# EAGLE design LEDCube (EAGLE 5.10)

## Sheet 1 of 4
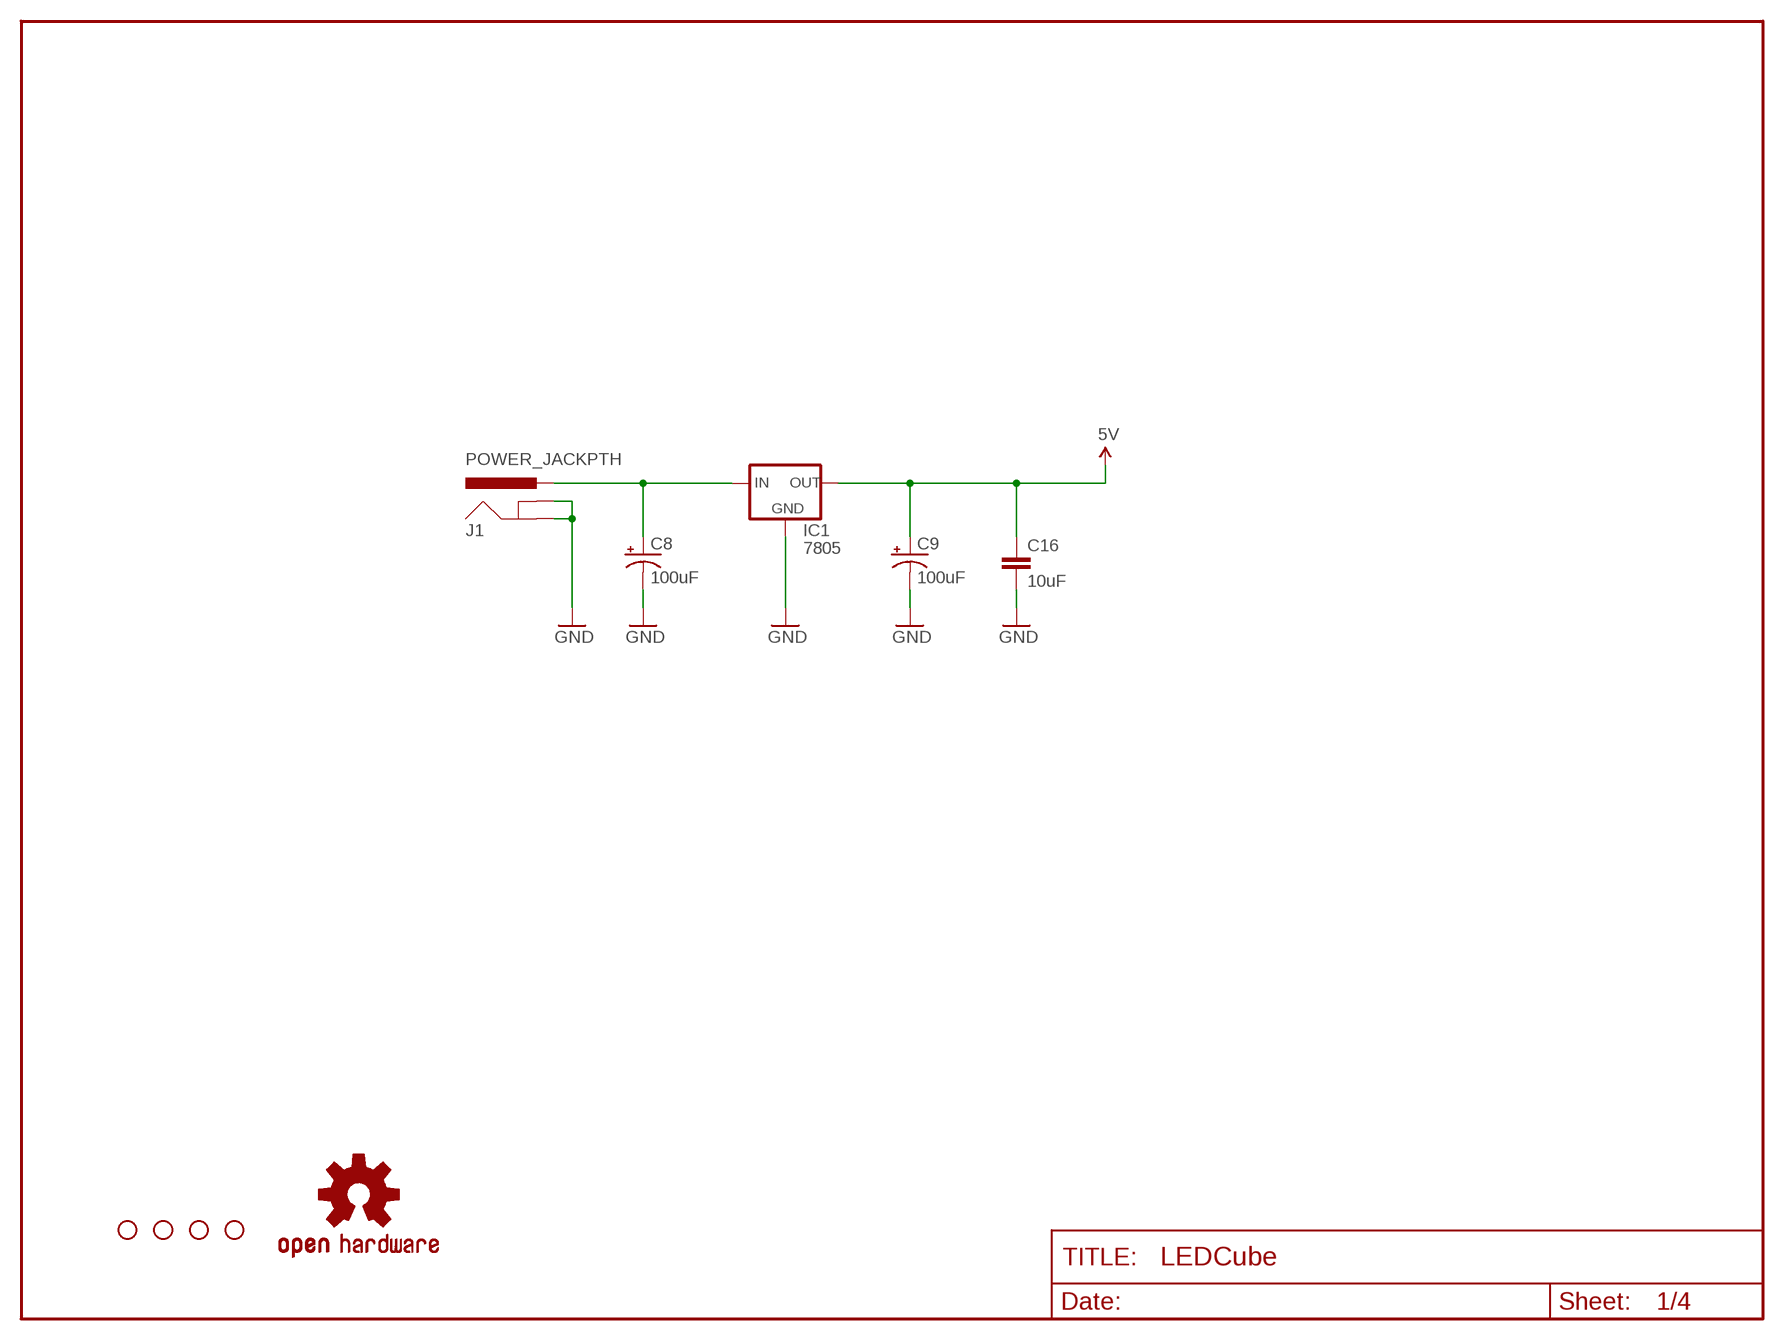
[diagram p0: schematic, sheet 1]

### Parts
C8  100uF  CAP_POLPTH1  [CPOL-RADIAL-100UF-25V]
C9  100uF  CAP_POLPTH1  [CPOL-RADIAL-100UF-25V]
C16  10uF  CAPPTH2  [CAP-PTH-SMALL2]
IC1  7805  V_REG_78XXSINK  [TO220-IGO]
J1  POWER_JACKPTH  [POWER_JACK_PTH]
JP4  STAND-OFF  [STAND-OFF]
JP5  STAND-OFF  [STAND-OFF]
JP6  STAND-OFF  [STAND-OFF]
JP7  STAND-OFF  [STAND-OFF]
U$10  OSHW-LOGOM  [OSHW-LOGO-M]

### Nets
5V: C9.1(+) C16.1 IC1.OUT ; also sheet 2,3,4
GND: C8.2(-) C9.2(-) C16.2 IC1.GND J1.GND J1.GNDBREAK ; also sheet 2,3,4
N$71: C8.1(+) IC1.IN J1.PWR

## Sheet 2 of 4
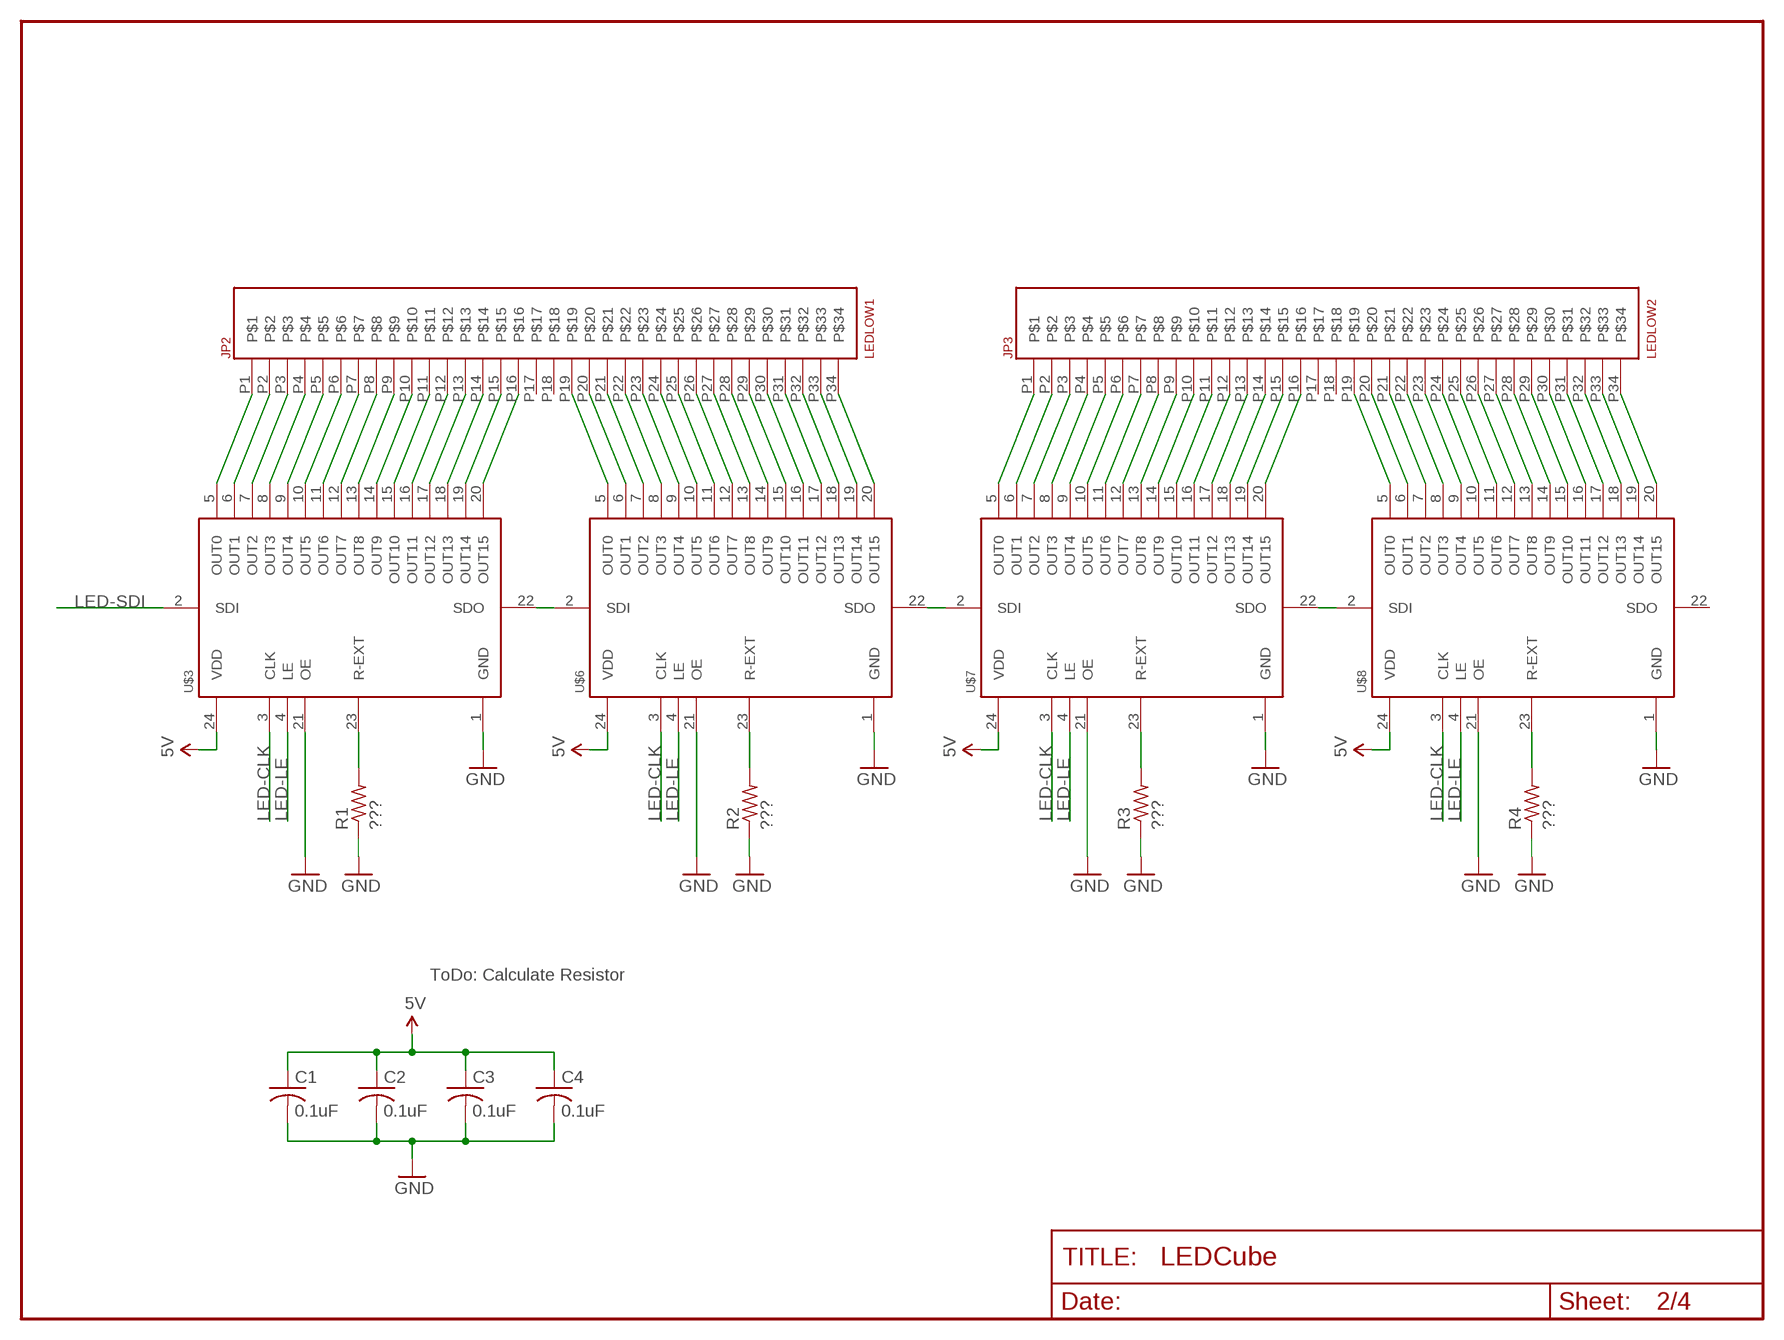
[diagram p1: schematic, sheet 2]

### Parts
C1  0.1uF  C-USC0805  [C0805]
C2  0.1uF  C-USC0805  [C0805]
C3  0.1uF  C-USC0805  [C0805]
C4  0.1uF  C-USC0805  [C0805]
JP2  LEDLOW1  M2X17  [2X17]
JP3  LEDLOW2  M2X17  [2X17]
R1  ???  R-US_R0805  [R0805]
R2  ???  R-US_R0805  [R0805]
R3  ???  R-US_R0805  [R0805]
R4  ???  R-US_R0805  [R0805]
U$3  TLC5925  [TSSOP24]
U$6  TLC5925  [TSSOP24]
U$7  TLC5925  [TSSOP24]
U$8  TLC5925  [TSSOP24]

### Nets
5V: C1.1 C2.1 C3.1 C4.1 U$3.24(VDD) U$6.24(VDD) U$7.24(VDD) U$8.24(VDD) ; also sheet 1,3,4
GND: C1.2 C2.2 C3.2 C4.2 R1.1 R2.1 R3.1 R4.1 U$3.1(GND) U$3.21(OE) U$6.1(GND) U$6.21(OE) U$7.1(GND) U$7.21(OE) U$8.1(GND) U$8.21(OE) ; also sheet 1,3,4
LED1TO2: U$3.22(SDO) U$6.2(SDI)
LED2TO3: U$6.22(SDO) U$7.2(SDI)
LED3-4: U$7.22(SDO) U$8.2(SDI)
LED-CLK: U$3.3(CLK) U$6.3(CLK) U$7.3(CLK) U$8.3(CLK) ; also sheet 4
LED-LE: U$3.4(LE) U$6.4(LE) U$7.4(LE) U$8.4(LE) ; also sheet 4
LED-SDI: U$3.2(SDI) ; also sheet 4
N$1: JP2.P1 U$3.5(OUT0)
N$2: JP2.P2 U$3.6(OUT1)
N$3: JP2.P3 U$3.7(OUT2)
N$4: R4.2 U$8.23(R-EXT)
N$5: R3.2 U$7.23(R-EXT)
N$6: R2.2 U$6.23(R-EXT)
N$7: R1.2 U$3.23(R-EXT)
N$8: JP2.P4 U$3.8(OUT3)
N$9: JP2.P5 U$3.9(OUT4)
N$10: JP2.P6 U$3.10(OUT5)
N$11: JP2.P7 U$3.11(OUT6)
N$12: JP2.P8 U$3.12(OUT7)
N$13: JP2.P9 U$3.13(OUT8)
N$14: JP2.P10 U$3.14(OUT9)
N$15: JP2.P11 U$3.15(OUT10)
N$16: JP2.P12 U$3.16(OUT11)
N$17: JP2.P13 U$3.17(OUT12)
N$18: JP2.P14 U$3.18(OUT13)
N$19: JP2.P15 U$3.19(OUT14)
N$20: JP2.P16 U$3.20(OUT15)
N$21: JP2.P34 U$6.20(OUT15)
N$22: JP2.P33 U$6.19(OUT14)
N$23: JP2.P32 U$6.18(OUT13)
N$24: JP2.P31 U$6.17(OUT12)
N$25: JP2.P30 U$6.16(OUT11)
N$26: JP2.P29 U$6.15(OUT10)
N$27: JP2.P28 U$6.14(OUT9)
N$28: JP2.P27 U$6.13(OUT8)
N$29: JP2.P26 U$6.12(OUT7)
N$30: JP2.P25 U$6.11(OUT6)
N$31: JP2.P24 U$6.10(OUT5)
N$32: JP2.P23 U$6.9(OUT4)
N$33: JP2.P22 U$6.8(OUT3)
N$34: JP2.P21 U$6.7(OUT2)
N$35: JP2.P20 U$6.6(OUT1)
N$36: JP2.P19 U$6.5(OUT0)
N$37: JP3.P1 U$7.5(OUT0)
N$38: JP3.P2 U$7.6(OUT1)
N$39: JP3.P3 U$7.7(OUT2)
N$40: JP3.P4 U$7.8(OUT3)
N$41: JP3.P5 U$7.9(OUT4)
N$42: JP3.P6 U$7.10(OUT5)
N$43: JP3.P7 U$7.11(OUT6)
N$44: JP3.P8 U$7.12(OUT7)
N$45: JP3.P9 U$7.13(OUT8)
N$46: JP3.P10 U$7.14(OUT9)
N$47: JP3.P11 U$7.15(OUT10)
N$48: JP3.P12 U$7.16(OUT11)
N$49: JP3.P13 U$7.17(OUT12)
N$50: JP3.P14 U$7.18(OUT13)
N$51: JP3.P15 U$7.19(OUT14)
N$52: JP3.P16 U$7.20(OUT15)
N$53: JP3.P34 U$8.20(OUT15)
N$54: JP3.P33 U$8.19(OUT14)
N$55: JP3.P32 U$8.18(OUT13)
N$56: JP3.P31 U$8.17(OUT12)
N$57: JP3.P30 U$8.16(OUT11)
N$58: JP3.P29 U$8.15(OUT10)
N$59: JP3.P28 U$8.14(OUT9)
N$60: JP3.P27 U$8.13(OUT8)
N$61: JP3.P26 U$8.12(OUT7)
N$62: JP3.P25 U$8.11(OUT6)
N$63: JP3.P24 U$8.10(OUT5)
N$64: JP3.P23 U$8.9(OUT4)
N$65: JP3.P22 U$8.8(OUT3)
N$66: JP3.P21 U$8.7(OUT2)
N$67: JP3.P20 U$8.6(OUT1)
N$68: JP3.P19 U$8.5(OUT0)
Unconnected: JP2.P17 JP2.P18 JP3.P17 JP3.P18 U$8.22(SDO)

### Notes on the sheet
- ToDo: Calculate Resistor

## Sheet 3 of 4
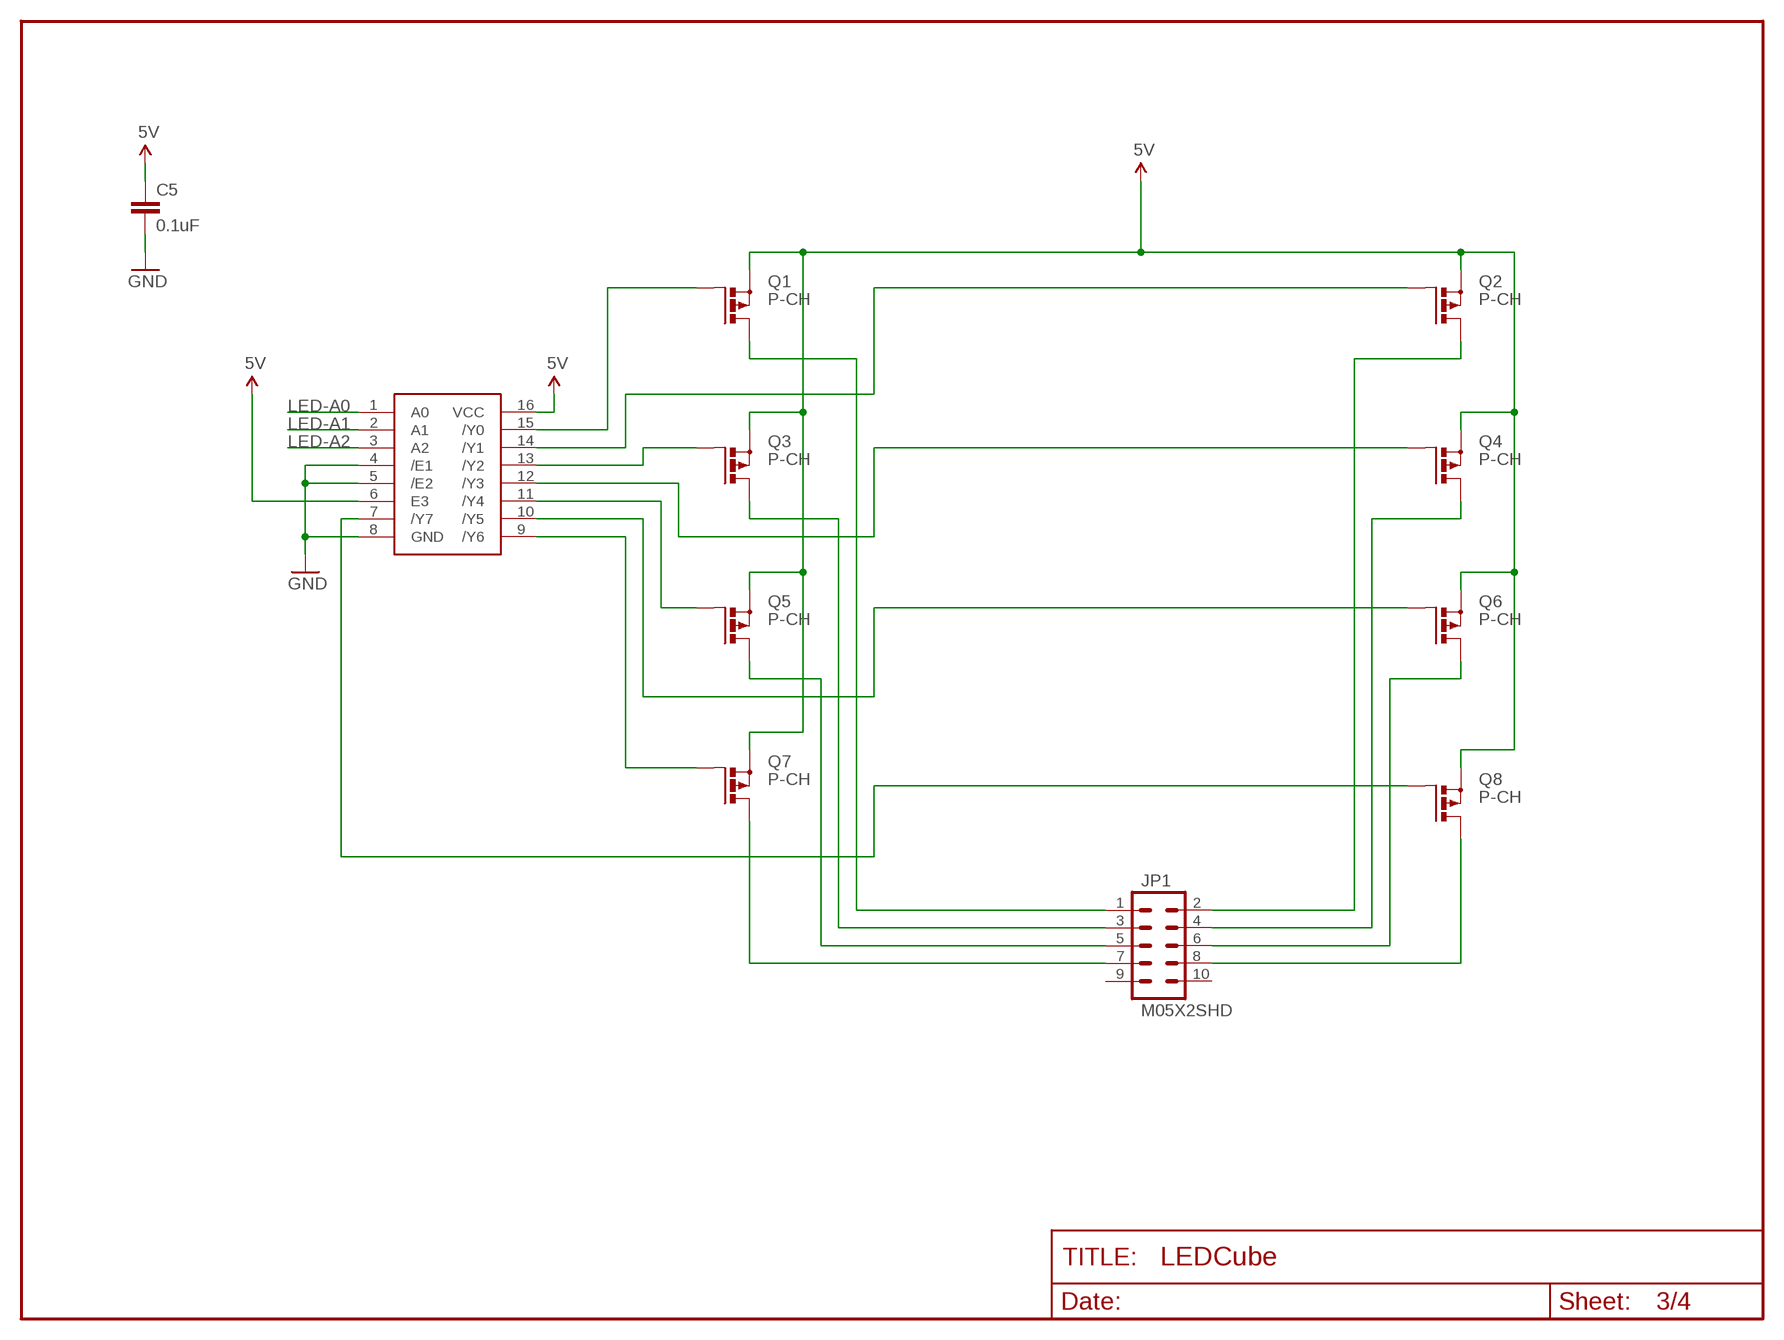
[diagram p2: schematic, sheet 3]

### Parts
C5  0.1uF  CAP0805  [0805]
JP1  M05X2SHD  [2X5-SHROUDED]
Q1  P-CH  PMOSFET_PTO220BV  [TO220BV]
Q2  P-CH  PMOSFET_PTO220BV  [TO220BV]
Q3  P-CH  PMOSFET_PTO220BV  [TO220BV]
Q4  P-CH  PMOSFET_PTO220BV  [TO220BV]
Q5  P-CH  PMOSFET_PTO220BV  [TO220BV]
Q6  P-CH  PMOSFET_PTO220BV  [TO220BV]
Q7  P-CH  PMOSFET_PTO220BV  [TO220BV]
Q8  P-CH  PMOSFET_PTO220BV  [TO220BV]
U$18  74LVC138AD  [SO016]

### Nets
5V: C5.1 Q1.S Q2.S Q3.S Q4.S Q5.S Q6.S Q7.S Q8.S U$18.6(E3) U$18.16(VCC) ; also sheet 1,2,4
GND: C5.2 U$18.4(/E1) U$18.5(/E2) U$18.8(GND) ; also sheet 1,2,4
LED-A0: U$18.1(A0) ; also sheet 4
LED-A1: U$18.2(A1) ; also sheet 4
LED-A2: U$18.3(A2) ; also sheet 4
LEDH1: JP1.1 Q1.D
LEDH2: JP1.2 Q2.D
LEDH3: JP1.3 Q3.D
LEDH4: JP1.4 Q4.D
LEDH5: JP1.5 Q5.D
LEDH6: JP1.6 Q6.D
LEDH7: JP1.7 Q7.D
LEDH8: JP1.8 Q8.D
N$72: Q8.G U$18.7(/Y7)
N$78: Q1.G U$18.15(/Y0)
N$79: Q2.G U$18.14(/Y1)
N$80: Q3.G U$18.13(/Y2)
N$81: Q4.G U$18.12(/Y3)
N$82: Q5.G U$18.11(/Y4)
N$83: Q6.G U$18.10(/Y5)
N$84: Q7.G U$18.9(/Y6)
Unconnected: JP1.9 JP1.10

## Sheet 4 of 4
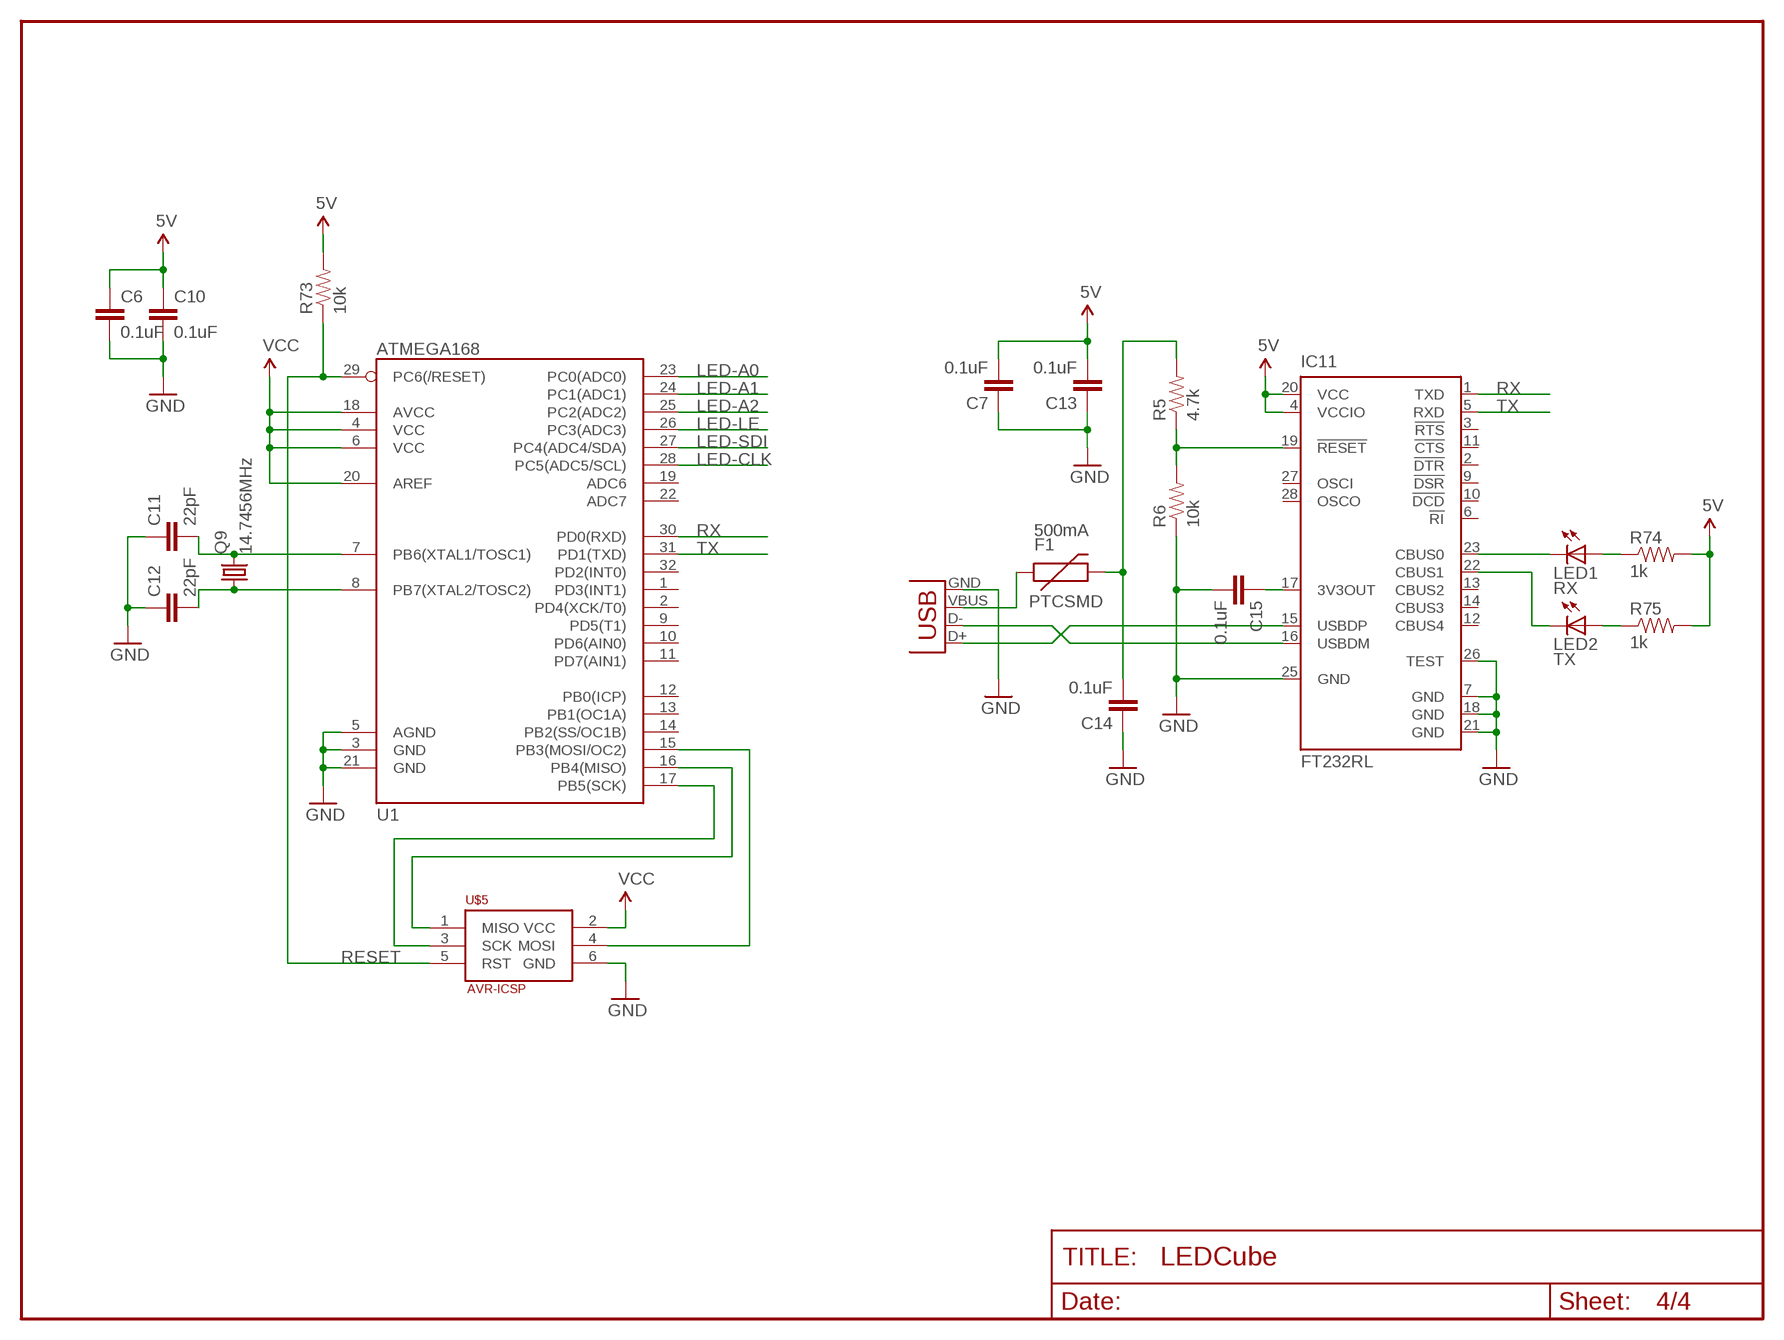
[diagram p3: schematic, sheet 4]

### Parts
C6  0.1uF  CAP0805  [0805]
C7  0.1uF  CAP0805  [0805]
C10  0.1uF  CAP0805  [0805]
C11  22pF  CAP0805  [0805]
C12  22pF  CAP0805  [0805]
C13  0.1uF  CAP0805  [0805]
C14  0.1uF  CAP0805  [0805]
C15  0.1uF  CAP0805  [0805]
F1  PTCSMD  [PTC-1206]
IC11  FT232RL  [SSOP28]
LED1  RX  LED1206  [LED-1206]
LED2  TX  LED1206  [LED-1206]
Q9  14.7456MHz  CRYSTALHC49US  [HC49US]
R5  4.7k  RESISTOR0805-RES  [0805]
R6  10k  RESISTOR0805-RES  [0805]
R73  10k  RESISTOR0805-RES  [0805]
R74  1k  RESISTOR0805-RES  [0805]
R75  1k  RESISTOR0805-RES  [0805]
U1  ATMEGA168  [TQFP32-08]
U$5  AVR-ICSP  AVR-ICSPAVR-ICSP  [AVR-ICSP]
X1  USBSMD  [USB-MINIB]

### Nets
5V: C6.1 C7.2 C10.1 C13.2 IC11.4(VCCIO) IC11.20(VCC) R73.2 R74.2 R75.2 U1.4(VCC) U1.6(VCC) U1.18(AVCC) U1.20(AREF) U$5.2(VCC) ; supply symbol labelled VCC ; also sheet 1,2,3
GND: C6.2 C7.1 C10.2 C11.1 C12.1 C13.1 C14.1 C15.2 IC11.7(GND) IC11.18(GND) IC11.21(GND) IC11.25(GND) IC11.26(TEST) R6.1 U1.3(GND) U1.5(AGND) U1.21(GND) U$5.6(GND) X1.GND ; also sheet 1,2,3
LED-A0: U1.23(PC0(ADC0)) ; also sheet 3
LED-A1: U1.24(PC1(ADC1)) ; also sheet 3
LED-A2: U1.25(PC2(ADC2)) ; also sheet 3
LED-CLK: U1.28(PC5(ADC5/SCL)) ; also sheet 2
LED-LE: U1.26(PC3(ADC3)) ; also sheet 2
LED-SDI: U1.27(PC4(ADC4/SDA)) ; also sheet 2
N$70: IC11.19(!RESET) R5.1 R6.2
N$156: C12.2 Q9.1 U1.8(PB7(XTAL2/TOSC2))
N$157: C11.2 Q9.2 U1.7(PB6(XTAL1/TOSC1))
N$160: IC11.23(CBUS0) LED1.C
N$161: U1.15(PB3(MOSI/OC2)) U$5.4(MOSI)
N$162: U1.16(PB4(MISO)) U$5.1(MISO)
N$163: U1.17(PB5(SCK)) U$5.3(SCK)
N$164: IC11.22(CBUS1) LED2.C
N$165: IC11.15(USBDP) X1.D+
N$166: LED2.A R75.1
N$167: LED1.A R74.1
N$168: IC11.16(USBDM) X1.D-
N$169: F1.1 X1.VBUS
N$170: C15.1 IC11.17(3V3OUT)
N$171: C14.2 F1.2 R5.2
RESET: R73.1 U1.29(PC6(/RESET)) U$5.5(RST)
RX: IC11.1(TXD) U1.30(PD0(RXD))
TX: IC11.5(RXD) U1.31(PD1(TXD))
Unconnected: IC11.2(!DTR) IC11.3(!RTS) IC11.6(!RI) IC11.9(!DSR) IC11.10(!DCD) IC11.11(!CTS) IC11.12(CBUS4) IC11.13(CBUS2) IC11.14(CBUS3) IC11.27(OSCI) IC11.28(OSCO) U1.1(PD3(INT1)) U1.2(PD4(XCK/T0)) U1.9(PD5(T1)) U1.10(PD6(AIN0)) U1.11(PD7(AIN1)) U1.12(PB0(ICP)) U1.13(PB1(OC1A)) U1.14(PB2(SS/OC1B)) U1.19(ADC6) U1.22(ADC7) U1.32(PD2(INT0))

### Notes on the sheet
- 500mA

## Library data of the parts
C1-C4 = resistor:C-US: CAPACITOR, American symbol
C5-C7 C10-C16 = SparkFun:CAP: Capacitor Standard 0603 ceramic capacitor, and 0.1" leaded capacitor.
C8 C9 = SparkFun:CAP_POL: Capacitor Polarized These are standard SMD and PTH capacitors. Normally 10uF, 47uF, and 100uF in electrolytic and tantalum varieties. Always verify the external diameter of the through hole cap, it varies with capacity, voltage, and manufacturer. The EIA devices should be standard.
F1 = SparkFun:PTC: Resettable Fuse PTC Resettable Fuse. Spark Fun Electronics SKU : COM-08357
IC1 = SparkFun:V_REG_78XX: Voltage Regulator Standard 7805 5V regulator. IGO (Input Ground Output). Spark Fun Electronics SKU : COM-00107
IC11 = ftdichip:FT232R: Source: http://www.ftdichip.com/Documents/DataSheets/DS_FT232R_v104.pdf
J1 = SparkFun:POWER_JACK: Power Jack This is the standard 5.5mm barrel jack for power. The PTH is the most common, proven, reliable, footprint. All others are experimental. The Slot footprint only works if the mill layer is transmitted to the PCB fab house so be warned. Spark Fun Electronics SKU : PRT-00119. Mating wall wart : TOL-00298 (and others)
JP1 = SparkFun:M05X2: Header 5x2 Standard 10-pin dual row 0.1" header. Commonly used with AVR-ISP. Use with Spark Fun Electronics SKU: PRT-00778
JP2 JP3 = FiveVolt:M2X17
JP4-JP7 = SparkFun:STAND-OFF: Stand Off This is the mechanical footprint for a #4 phillips button head screw. Use the keepout ring to avoid running the screw head into surrounding components. SKU : PRT-00447
LED1 LED2 = SparkFun:LED: LEDs Standard schematic elements and footprints for 5mm, 3mm, 1206, and 0603 sized LEDs. 5mm - Spark Fun Electronics SKU : COM-00529 (and others)
Q1-Q8 = transistor-power:PMOSFET_P: Power MOSFET P-Channel
Q9 = SparkFun:CRYSTAL: Crystals Various standard crystals. Proven footprints. Spark Fun Electronics SKU : COM-00534
R1-R4 = resistor:R-US_: RESISTOR, American symbol
R5 R6 R73-R75 = SparkFun:RESISTOR: Resistor Basic schematic elements and footprints for 0603, 1206, and PTH resistors.
U1 = SparkFun:ATMEGA168
U$3 U$6-U$8 = FiveVolt:TLC5925
U$5 = FiveVolt:AVR-ICSP; EAGLEUP: JP3Q
U$10 = SparkFun:OSHW-LOGO: Open Source Hardware Logo This logo indicates the piece of hardware it is found on incorporates a OSHW license and/or adheres to the definition of open source hardware found here: http://freedomdefined.org/OSHW
U$18 = SparkFun:74LVC138AD
X1 = SparkFun:USB: USB Connectors USB-B-PTH is fully proven SKU : PRT-00139 USB-miniB is fully proven SKU : PRT-00587 USB-A-PCB is untested. USB-A-H is throughly reviewed, but untested. Spark Fun Electronics SKU : PRT-00437 USB-B-SMT is throughly reviewed, but untested. Needs silkscreen touching up. USB-A-S has not been used/tested USB-MB-H has not been used/tested

## Board
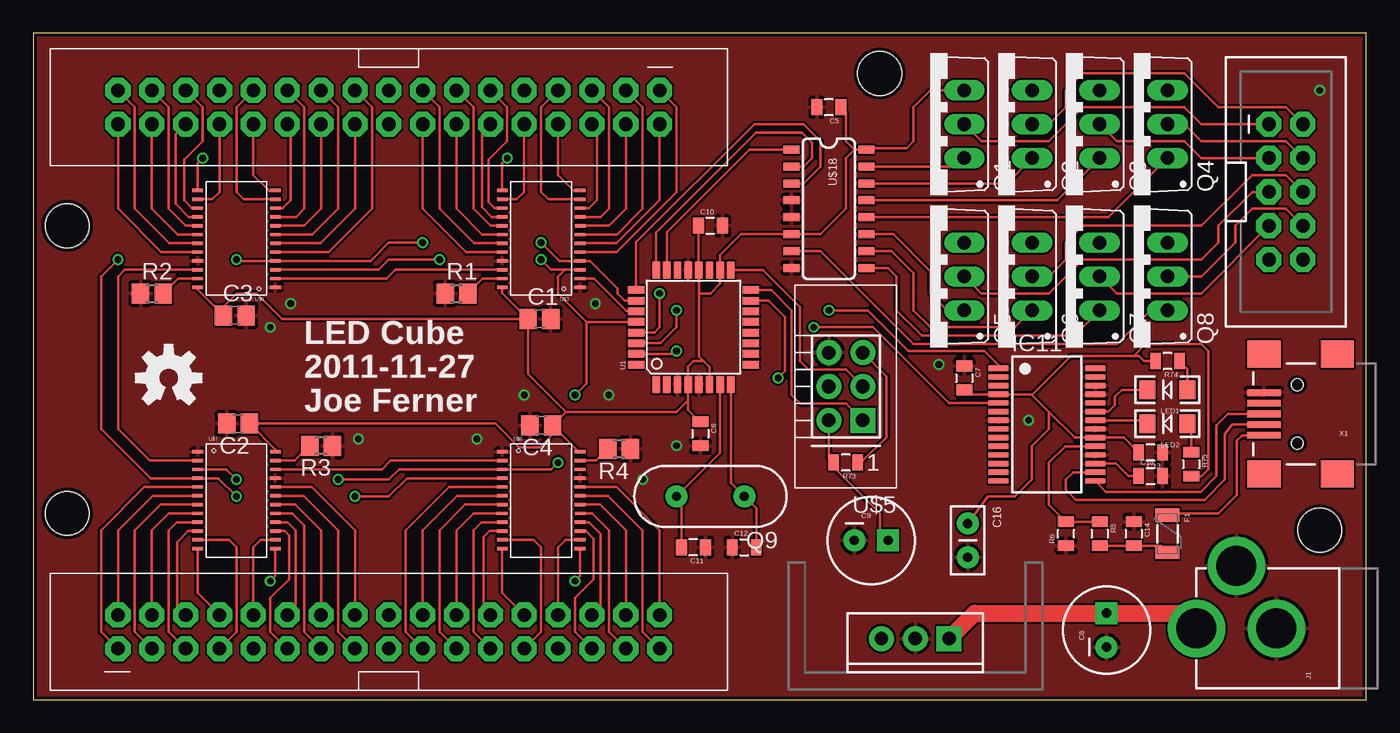
[diagram p4: board, top side]
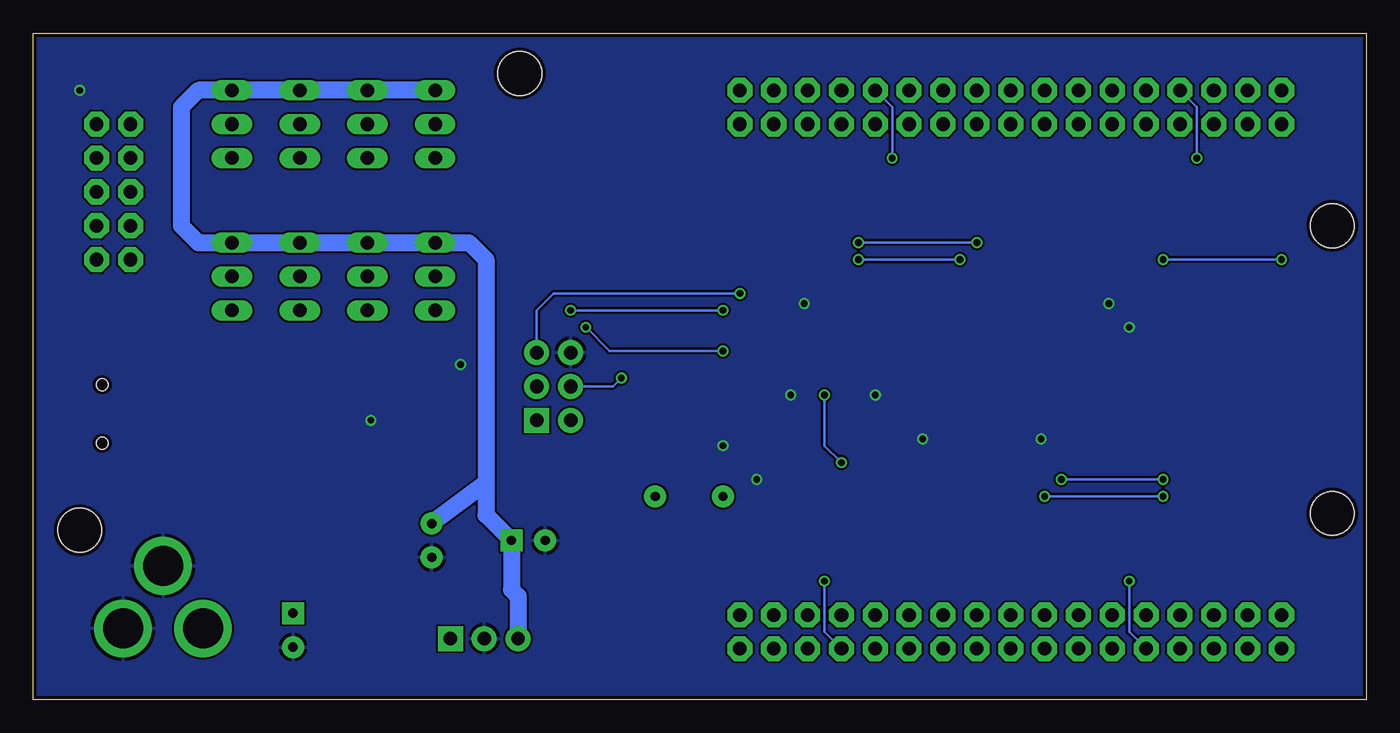
[diagram p5: board, bottom side, seen from below]

Size 100 x 50 mm. Coordinates in mm from the lower left corner, seen from the top.
Outline: 0,0 100,0 100,50 0,50 0,0
Copper layers (1*16): Top 0.035mm / dielectric 1.5mm / Bottom 0.035mm
Design rules "ITead_rule": minimum track width 6mil, minimum drill 12mil, track to track 6mil, track to pad 6mil, pad to pad 6mil, via to via 6mil, smd to smd 0mil, copper to edge 10mil, drill to drill 10mil, minimum pad ring 10mil, minimum via ring 6mil, stop-mask expansion 2mil, vias tented up to drill 100mil, thermal gap 10mil

### Footprints (pad centres in the part's own frame; a part is rotated, then mirrored left to right if it is on the bottom)
C0805 = smd 1.3 x 1.5: 1 -0.85,0; 2 0.85,0
0805 = smd 0.8 x 1.2: 1 -0.9,0; 2 0.9,0
CPOL-RADIAL-100UF-25V = drill 0.7 pad 1.651 square: 1 1.27,0 | drill 0.7 pad 1.651 round: 2 -1.27,0
CAP-PTH-SMALL2 = drill 0.7 pad 1.651 round: 1 0,0; 2 2.54,0
PTC-1206 = smd 1 x 1.8: 1 -1.4,0; 2 1.4,0
TO220-IGO = drill 1 pad 1.88 round: GND 0,0; OUT 2.54,0 | drill 1 pad 1.88 square: IN -2.54,0
SSOP28 = smd 0.4 x 1.5: 1 -4.225,-3.625; 2 -3.575,-3.625; 3 -2.925,-3.625; 4 -2.275,-3.625; 5 -1.625,-3.625; 6 -0.975,-3.625; 7 -0.325,-3.625; 8 0.325,-3.625; 9 0.975,-3.625; 10 1.625,-3.625; 11 2.275,-3.625; 12 2.925,-3.625; 13 3.575,-3.625; 14 4.225,-3.625; 15 4.225,3.625; 16 3.575,3.625; 17 2.925,3.625; 18 2.275,3.625; 19 1.625,3.625; 20 0.975,3.625; 21 0.325,3.625; 22 -0.325,3.625; 23 -0.975,3.625; 24 -1.625,3.625; 25 -2.275,3.625; 26 -2.925,3.625; 27 -3.575,3.625; 28 -4.225,3.625
POWER_JACK_PTH = drill 2.997 pad 4.318 round: GND 0,7.7; GNDBREAK 4.7,10.7; PWR 0,13.7
2X5-SHROUDED = drill 1.016 pad 1.88 octagon: 1 -1.27,5.08; 2 1.27,5.08; 3 -1.27,2.54; 4 1.27,2.54; 5 -1.27,0; 6 1.27,0; 7 -1.27,-2.54; 8 1.27,-2.54; 9 -1.27,-5.08; 10 1.27,-5.08
2X17 = drill 1.016 pad 1.88 octagon: P1 -20.32,-1.27; P2 -20.32,1.27; P3 -17.78,-1.27; P4 -17.78,1.27; P5 -15.24,-1.27; P6 -15.24,1.27; P7 -12.7,-1.27; P8 -12.7,1.27; P9 -10.16,-1.27; P10 -10.16,1.27; P11 -7.62,-1.27; P12 -7.62,1.27; P13 -5.08,-1.27; P14 -5.08,1.27; P15 -2.54,-1.27; P16 -2.54,1.27; P17 0,-1.27; P18 0,1.27; P19 2.54,-1.27; P20 2.54,1.27; P21 5.08,-1.27; P22 5.08,1.27; P23 7.62,-1.27; P24 7.62,1.27; P25 10.16,-1.27; P26 10.16,1.27; P27 12.7,-1.27; P28 12.7,1.27; P29 15.24,-1.27; P30 15.24,1.27; P31 17.78,-1.27; P32 17.78,1.27; P33 20.32,-1.27; P34 20.32,1.27
STAND-OFF = hole 3.302: 0,0
LED-1206 = smd 1.2 x 1.4: A -1.5,0; C 1.5,0
TO220BV = drill 1.016 long: D 0,-2.54; G -2.54,-2.54; S 2.54,-2.54
HC49US = drill 0.7 pad 1.651 round: 1 -2.54,0; 2 2.54,0
R0805 = smd 1.3 x 1.5: 1 -0.85,0; 2 0.85,0
TQFP32-08 = smd 1.27 x 0.559: 1 -4.293,2.8; 2 -4.293,2; 3 -4.293,1.2; 4 -4.293,0.4; 5 -4.293,-0.4; 6 -4.293,-1.2; 7 -4.293,-2; 8 -4.293,-2.8; 17 4.293,-2.8; 18 4.293,-2; 19 4.293,-1.2; 20 4.293,-0.4; 21 4.293,0.4; 22 4.293,1.2; 23 4.293,2; 24 4.293,2.8 | smd 0.559 x 1.27: 9 -2.8,-4.293; 10 -2,-4.293; 11 -1.2,-4.293; 12 -0.4,-4.293; 13 0.4,-4.293; 14 1.2,-4.293; 15 2,-4.293; 16 2.8,-4.293; 25 2.8,4.293; 26 2,4.293; 27 1.2,4.293; 28 0.4,4.293; 29 -0.4,4.293; 30 -1.2,4.293; 31 -2,4.293; 32 -2.8,4.293
TSSOP24 = smd 0.8 x 0.25: 1 -2.921,3.353; 2 -2.921,2.692; 3 -2.921,2.032; 4 -2.921,1.372; 5 -2.921,0.711; 6 -2.921,0.051; 7 -2.921,-0.61; 8 -2.927,-1.27; 9 -2.921,-1.93; 10 -2.921,-2.591; 11 -2.921,-3.251; 12 -2.921,-3.912; 13 2.921,-3.912; 14 2.921,-3.251; 15 2.921,-2.591; 16 2.921,-1.93; 17 2.927,-1.27; 18 2.921,-0.61; 19 2.921,0.051; 20 2.921,0.711; 21 2.921,1.372; 22 2.921,2.032; 23 2.921,2.692; 24 2.921,3.353
AVR-ICSP = drill 1.016 pad 1.88 square: 1 -1.27,2.54 | drill 1.016 pad 1.88 round: 2 1.27,2.54; 3 -1.27,0; 4 1.27,0; 5 -1.27,-2.54; 6 1.27,-2.54
SO016 = smd 0.6 x 1.2: 1 -4.445,-2.8; 2 -3.175,-2.8; 3 -1.905,-2.8; 4 -0.635,-2.8; 5 0.635,-2.8; 6 1.905,-2.8; 7 3.175,-2.8; 8 4.445,-2.8; 9 4.445,2.8; 10 3.175,2.8; 11 1.905,2.8; 12 0.635,2.8; 13 -0.635,2.8; 14 -1.905,2.8; 15 -3.175,2.8; 16 -4.445,2.8
USB-MINIB = smd 2.5 x 0.5: D+ 2.5,0; D- 2.5,0.8; GND 2.5,-1.6; ID 2.5,-0.8; VBUS 2.5,1.6 | smd 2.5 x 2: MTN1 -3,4.5; MTN2 2.5,4.5; MTN3 -3,-4.5; MTN4 2.5,-4.5 | hole 0.9: 0,2.2; 0,-2.2

### Placement (x,y rotation side)
C1  37.97,28.57 0 top
C2  15.37,20.7 180 top
C3  15.11,28.83 0 top
C4  38.1,20.57 180 top
C5  59.69,44.45 180 top
C6  50.04,19.94 270 top
C7  69.85,24.13 270 top
C8  80.52,5.21 90 top
C9  62.87,11.94 0 top
C10  50.8,35.56 0 top
C11  49.53,11.43 180 top
C12  53.34,11.43 0 top
C13  83.82,18.54 180 top
C14  82.55,12.45 270 top
C15  83.82,16.76 0 top
C16  70.1,13.21 270 top
F1  85.09,12.45 270 top
IC1  66.17,4.57 180 top
IC11  76.04,20.63 270 top
J1  100.97,5.33 90 top
JP1  93.98,38.1 0 top
JP2  26.67,44.45 180 top
JP3  26.67,5.08 0 top
JP4  2.54,35.56 0 top
JP5  2.54,13.97 0 top
JP6  96.52,12.7 0 top
JP7  63.5,46.99 0 top
LED1  85.09,23.24 180 top
LED2  85.09,20.7 180 top
Q1  67.31,43.18 90 top
Q2  72.39,43.18 90 top
Q3  77.47,43.18 90 top
Q4  82.55,43.18 90 top
Q5  67.31,31.75 90 top
Q6  72.39,31.75 90 top
Q7  77.47,31.75 90 top
Q8  82.55,31.75 90 top
Q9  50.8,15.24 180 top
R1  31.75,30.48 0 top
R2  8.89,30.48 0 top
R3  21.59,19.05 180 top
R4  43.94,18.8 180 top
R5  80.01,12.45 270 top
R6  77.47,12.45 90 top
R73  60.96,17.78 180 top
R74  85.09,25.4 180 top
R75  86.87,17.65 270 top
U1  49.53,27.94 90 top
U$3  38.1,34.29 180 top
U$5  60.96,23.5 180 top
U$6  15.24,34.29 180 top
U$7  15.24,15.24 0 top
U$8  38.1,15.24 0 top
U$10  10.16,24.13 0 top
U$18  59.69,36.83 270 top
X1  94.83,21.43 180 top

### Tracks (layer width: path | path; a pad name or v marks a point on that pad's centre or on a via)
5V
  Top 0.203: U$7.24 18.16,18.76 C2.1 34.67,20.7 36.45,18.92 37.97,18.92 38.95,19.9 C4.1 | U$8.24 40.93,18.59 C4.1 | U$6.24 12.32,30.77 C3.1 14.26,29.5 15.24,30.48 16.76,30.48 18.67,28.57 C1.1 | 61.59,41.27 U$18.16 62.48,41.4 65.53,41.4 66.04,41.91 66.04,44.45 67.31,45.72 Q1.S | 61.59,41.27 60.96,40.64 60.96,36.83 59.05,34.92 U$18.6 53.09,34.92 51.53,33.37 U1.18 51.53,31.21 50.8,30.48 49.93,30.48 | 61.59,41.27 60.96,41.91 60.96,44.08 C5.1 | 76.2,21.59 74.93,22.86 | 74.93,22.86 74.89,22.91 IC11.4 70.17,22.91 C7.2 | 76.2,21.59 78.14,19.66 IC11.20 81.81,19.66 C13.2 | U1.6 50.73,24.96 50.29,25.4 | 50.29,25.4 49.53,25.4 49.13,25 U1.4 49.13,22.46 | 49.93,30.48 49.93,25.76 50.29,25.4 | 49.93,30.48 U1.20 49.9,32.26 C10.1 | C4.1 39.97,21.59 | 49.13,22.46 48.26,21.59 39.97,21.59 | 49.13,22.46 49.13,21.75 C6.1 | C1.1 37.12,24.43 39.97,21.59 | 76.2,21.59 76.2,20.32 74.93,19.05 74.93,16.51 73.66,15.24 71.63,15.24 C16.1 | R74.2 83.31,25.4 82.93,25.78 82.55,25.78 | 82.55,25.78 77.85,25.78 74.93,22.86 | R75.2 87.62,16.75 88.14,17.27 88.14,26.16 87.63,26.67 83.44,26.67 82.55,25.78 | U$3.24 35.18,30.52 C1.1 | C9.1 63.5,12.57 63.5,13.97 60.06,17.41 R73.2 59.69,18.15 U$5.2
  Bottom 1.27: Q1.S Q2.S Q3.S Q4.S 87.63,45.72 88.9,44.45 88.9,35.56 87.63,34.29 Q8.S Q7.S Q6.S Q5.S 67.31,34.29 66.04,33.02 66.04,16.26 | 66.04,16.26 C16.1 | 66.04,16.26 66.04,13.84 C9.1 64.14,8.26 63.63,7.75 IC1.OUT
GND  (via drill 0.51)
  other vias: 96.52,45.72 42.16,29.72 48.26,19.05 45.72,16.51 43.18,22.86 67.94,25.15 74.68,20.95 19.3,29.72 17.78,27.94 24.38,19.56 33.27,19.56 36.83,22.86
  pour Top: -2.54,52.07 -2.54,-2.54 102.87,-2.54 102.87,52.07
  pour Bottom: -1.27,50.8 -1.27,-1.27 101.6,-1.27 101.6,50.8
LED1TO2
  Top 0.203: U$6.2 26.52,31.6 27.18,32.26 U$3.22
LED2TO3
  Top 0.203: U$6.22 6.86,32.26 6.35,31.75 6.35,20.32 8.74,17.93 U$7.2
LED3-4
  Top 0.203: U$7.22 26.16,17.27 26.82,17.93 U$8.2
LED-A0
  Top 0.203: U1.23 47.53,35.08 53.72,41.27 U$18.1
LED-A1
  Top 0.203: U1.24 46.73,35.05 54.23,42.55 57.66,42.55 58.42,41.78 58.42,40.64 57.78,40.01 U$18.2
LED-A2
  Top 0.203: U1.25 45.24,34.31 54.1,43.18 57.78,43.18 59.05,41.91 59.05,40.01 57.78,38.73 U$18.3
LED-CLK  (via drill 0.51)
  Top 0.203: v22.86,16.51 26.67,16.51 27.43,17.27 U$8.3 38.86,17.27 v39.37,17.78 | U$7.3 14.48,17.27 v15.24,16.51 | U$6.3 25.91,32.26 26.67,33.02 v30.48,33.02 | v38.1,33.02 38.86,32.26 U$3.3 39.88,32.26 39.37,31.75 39.37,30.48 41.51,28.34 | 41.51,28.34 U1.28 | 41.51,28.34 41.51,23.73 v40.64,22.86
  Bottom 0.203: v15.24,16.51 v22.86,16.51 | v38.1,33.02 v30.48,33.02 | v40.64,22.86 40.64,19.05 v39.37,17.78
LED-LE  (via drill 0.51)
  Top 0.203: U$8.4 28.04,16.61 26.67,15.24 v24.13,15.24 | v15.24,15.24 13.87,16.61 U$7.4 8.79,16.61 5.08,20.32 5.08,31.75 v6.35,33.02 | v29.21,34.29 26.67,34.29 25.3,32.92 U$6.4 15.34,32.92 v15.24,33.02 | v38.1,34.29 39.47,32.92 U$3.4 41.76,32.92 43.81,30.86 43.81,30.48 44.35,29.94 U1.26
  Bottom 0.203: v15.24,15.24 v24.13,15.24 | v29.21,34.29 v38.1,34.29 | v6.35,33.02 v15.24,33.02
LED-SDI
  Top 0.203: U1.27 44.52,29.14 42.06,31.6 U$3.2
LEDH1
  Top 0.203: JP1.1 87.63,43.18 86.36,44.45 78.74,44.45 76.2,41.91 71.12,41.91 Q1.D
LEDH2
  Top 0.203: JP1.2 93.98,44.45 88.9,44.45 86.36,46.99 78.74,46.99 77.47,45.72 77.47,44.45 76.2,43.18 Q2.D
LEDH3
  Top 0.203: JP1.3 87.63,40.64 86.36,41.91 81.28,41.91 Q3.D
LEDH4
  Top 0.203: JP1.4 93.98,41.91 87.63,41.91 86.36,43.18 Q4.D
LEDH5
  Top 0.203: Q5.D 71.12,30.48 76.2,30.48 78.74,33.02 87.63,33.02 88.9,34.29 88.9,35.56 91.44,38.1 JP1.5
LEDH6
  Top 0.203: Q6.D 76.2,31.75 77.47,33.02 77.47,34.29 78.74,35.56 87.63,35.56 91.44,39.37 93.98,39.37 JP1.6
LEDH7
  Top 0.203: Q7.D 81.28,30.48 87.63,30.48 JP1.7
LEDH8
  Top 0.203: JP1.8 93.98,36.83 91.44,36.83 90.17,35.56 90.17,34.29 87.63,31.75 Q8.D
N$1
  Top 0.203: JP2.P1 48.26,44.45 48.26,38.1 43.74,33.58 U$3.5
N$2
  Top 0.203: U$3.6 43.76,34.24 46.99,37.47 JP2.P2
N$3
  Top 0.203: U$3.7 43.79,34.9 45.72,36.83 45.72,44.45 JP2.P3
N$4
  Top 0.203: U$8.23 42.23,17.93 R4.2
N$5
  Top 0.203: U$7.23 19.62,17.93 R3.2
N$6
  Top 0.203: U$6.23 10.86,31.6 R2.2
N$7
  Top 0.203: U$3.23 33.72,31.6 R1.2
N$8
  Top 0.203: U$3.8 43.18,35.56 44.45,36.83 JP2.P4
N$9
  Top 0.203: JP2.P5 43.18,44.45 43.18,36.83 42.57,36.22 U$3.9
N$10
  Top 0.203: U$3.10 41.71,36.88 42.29,37.47 42.29,42.8 JP2.P6
N$11
  Top 0.203: JP2.P7 38.1,44.45 38.1,38.1 38.66,37.54 U$3.11
N$12
  Top 0.203: U$3.12 40.54,38.2 39.37,39.37 JP2.P8
N$13  (via drill 0.51)
  Top 0.203: U$3.13 35.18,40.26 v35.56,40.64
  Bottom 0.203: JP2.P9 35.56,44.45 v35.56,40.64
N$14
  Top 0.203: JP2.P10 36.83,38.1 36.27,37.54 U$3.14
N$15
  Top 0.203: JP2.P11 35.56,44.45 35.56,41.91 34.16,40.51 34.16,37.34 34.62,36.88 U$3.15
N$16
  Top 0.203: U$3.16 34.39,36.22 33.66,36.96 33.66,42.55 JP2.P12
N$17
  Top 0.203: JP2.P13 33.02,44.45 33.02,36.83 34.29,35.56 U$3.17
N$18
  Top 0.203: U$3.18 33.68,34.9 31.75,36.83 JP2.P14
N$19
  Top 0.203: U$3.19 33.07,34.24 30.48,36.83 30.48,44.45 JP2.P15
N$20
  Top 0.203: U$3.20 32.46,33.58 29.21,36.83 JP2.P16
N$21
  Top 0.203: U$6.20 9.6,33.58 6.35,36.83 JP2.P34
N$22
  Top 0.203: U$6.19 10.21,34.24 7.62,36.83 7.62,44.45 JP2.P33
N$23
  Top 0.203: U$6.18 10.82,34.9 8.89,36.83 JP2.P32
N$24
  Top 0.203: U$6.17 11.43,35.56 10.16,36.83 10.16,44.45 JP2.P31
N$25
  Top 0.203: U$6.16 11.66,36.22 10.67,37.21 10.67,42.42 JP2.P30
N$26
  Top 0.203: U$6.15 11.89,36.88 11.3,37.47 11.3,40.51 12.7,41.91 12.7,44.45 JP2.P29
N$27
  Top 0.203: U$6.14 13.41,37.54 13.97,38.1 JP2.P28
N$28  (via drill 0.51)
  Top 0.203: U$6.13 12.32,40.26 v12.7,40.64
  Bottom 0.203: JP2.P27 12.7,44.45 v12.7,40.64
N$29
  Top 0.203: U$6.12 17.68,38.2 16.51,39.37 JP2.P26
N$30
  Top 0.203: U$6.11 15.8,37.54 15.24,38.1 15.24,44.45 JP2.P25
N$31
  Top 0.203: U$6.10 18.72,36.88 19.3,37.47 19.3,42.93 JP2.P24
N$32
  Top 0.203: JP2.P23 20.32,44.45 20.32,36.83 19.71,36.22 U$6.9
N$33
  Top 0.203: U$6.8 20.32,35.56 21.59,36.83 JP2.P22
N$34
  Top 0.203: U$6.7 20.93,34.9 22.86,36.83 22.86,44.45 JP2.P21
N$35
  Top 0.203: U$6.6 21.54,34.24 24.13,36.83 JP2.P20
N$36
  Top 0.203: U$6.5 22.15,33.58 25.4,36.83 25.4,44.45 JP2.P19
N$37
  Top 0.203: JP3.P1 5.08,5.08 5.08,12.7 8.33,15.95 U$7.5
N$38
  Top 0.203: U$7.6 8.94,15.29 6.35,12.7 JP3.P2
N$39
  Top 0.203: JP3.P3 7.62,5.08 7.62,12.7 9.55,14.63 U$7.7
N$40
  Top 0.203: U$7.8 10.16,13.97 8.89,12.7 JP3.P4
N$41
  Top 0.203: JP3.P5 10.16,5.08 10.16,12.7 10.77,13.31 U$7.9
N$42
  Top 0.203: JP3.P6 10.79,6.99 10.79,11.81 11.63,12.65 U$7.10
N$43
  Top 0.203: JP3.P7 15.24,5.08 15.24,11.43 14.68,11.99 U$7.11
N$44
  Top 0.203: U$7.12 12.32,8 JP3.P8
N$45  (via drill 0.51)
  Top 0.203: U$7.13 18.16,9.27 v17.78,8.89
  Bottom 0.203: JP3.P9 17.78,5.08 v17.78,8.89
N$46
  Top 0.203: U$7.14 17.07,11.99 16.51,11.43 JP3.P10
N$47
  Top 0.203: U$7.15 18.85,12.65 19.18,12.32 19.18,9.02 17.78,7.62 17.78,5.08 JP3.P11
N$48
  Top 0.203: U$7.16 19.07,13.31 19.68,12.7 19.68,7.11 JP3.P12
N$49
  Top 0.203: U$7.17 19.43,13.97 20.32,13.08 20.32,5.08 JP3.P13
N$50
  Top 0.203: U$7.18 19.66,14.63 21.59,12.7 JP3.P14
N$51
  Top 0.203: U$7.19 20.27,15.29 22.86,12.7 22.86,5.08 JP3.P15
N$52
  Top 0.203: U$7.20 20.88,15.95 24.13,12.7 JP3.P16
N$53
  Top 0.203: U$8.20 43.74,15.95 46.99,12.7 JP3.P34
N$54
  Top 0.203: JP3.P33 45.72,5.08 45.72,12.7 43.13,15.29 U$8.19
N$55
  Top 0.203: U$8.18 42.52,14.63 44.45,12.7 JP3.P32
N$56
  Top 0.203: U$8.17 41.91,13.97 43.18,12.7 43.18,5.08 JP3.P31
N$57
  Top 0.203: U$8.16 41.68,13.31 42.55,12.45 42.55,6.99 JP3.P30
N$58
  Top 0.203: U$8.15 41.45,12.65 42.04,12.06 42.04,9.02 40.64,7.62 40.64,5.08 JP3.P29
N$59
  Top 0.203: U$8.14 39.93,11.99 39.37,11.43 JP3.P28
N$60  (via drill 0.51)
  Top 0.203: U$8.13 41.02,9.27 v40.64,8.89
  Bottom 0.203: JP3.P27 40.64,5.08 v40.64,8.89
N$61
  Top 0.203: U$8.12 35.18,8 JP3.P26
N$62
  Top 0.203: JP3.P25 38.1,5.08 38.1,11.43 37.54,11.99 U$8.11
N$63
  Top 0.203: U$8.10 34.24,12.65 33.78,12.19 33.78,6.86 JP3.P24
N$64
  Top 0.203: U$8.9 33.63,13.31 33.02,12.7 33.02,5.08 JP3.P23
N$65
  Top 0.203: U$8.8 33.02,13.97 31.75,12.7 JP3.P22
N$66
  Top 0.203: JP3.P21 30.48,5.08 30.48,12.7 32.41,14.63 U$8.7
N$67
  Top 0.203: U$8.6 31.8,15.29 29.21,12.7 JP3.P20
N$68
  Top 0.203: JP3.P19 27.94,5.08 27.94,12.7 31.19,15.95 U$8.5
N$70
  Top 0.203: R5.1 R6.2 76.2,14.62 76.2,17.78 77.42,19 IC11.19
N$71
  Top 1.27: J1.PWR 86.12,6.48 C8.1 70.61,6.48 IC1.IN
N$72
  Top 0.203: U$18.7 59.05,33.66 66.04,26.67 81.28,26.67 83.82,29.21 Q8.G
N$78
  Top 0.203: U$18.15 69.22,40.01 Q1.G
N$79
  Top 0.203: U$18.14 73.03,38.73 Q2.G
N$80
  Top 0.203: U$18.13 76.83,37.47 Q3.G
N$81
  Top 0.203: U$18.12 80.64,36.2 Q4.G
N$82
  Top 0.203: U$18.11 64.52,34.92 67.31,32.13 67.31,30.48 68.58,29.21 Q5.G
N$83
  Top 0.203: U$18.10 64.39,33.66 66.04,32 66.04,29.21 67.31,27.94 73.66,27.94 Q6.G
N$84
  Top 0.203: U$18.9 64.14,32.38 64.77,31.75 64.77,29.21 66.67,27.3 78.11,27.3 Q7.G
N$156
  Top 0.203: C12.2 54.24,14.34 Q9.1 52.33,16.25 U1.8
N$157
  Top 0.203: U1.7 51.53,18.51 Q9.2 48.63,14.87 C11.2
N$160
  Top 0.203: IC11.23 80.66,21.61 81.15,22.1 81.15,22.73 81.66,23.24 LED1.C
N$161  (via drill 0.51)
  Top 0.203: U1.15 55.15,29.94 56.39,28.7 56.39,24.64 v55.88,24.13
  Bottom 0.203: U$5.4 56.52,23.5 v55.88,24.13
N$162
  Top 0.203: U$5.1 60.96,22.23 57.53,22.23 56.9,22.86 56.9,29.21 55.37,30.74 U1.16
N$163
  Top 0.203: U$5.3 60.96,24.77 58.17,24.77 57.53,25.4 57.53,29.46 54.76,32.23 U1.17
N$164
  Top 0.203: IC11.22 83.34,20.95 LED2.C
N$165
  Top 0.203: IC11.15 80.48,15.59 87.6,15.59 88.77,16.76 88.77,20.57 89.63,21.43 X1.D+
N$166
  Top 0.203: R75.1 86.87,20.42 LED2.A
N$167
  Top 0.203: LED1.A 86.59,24.8 R74.1
N$168
  Top 0.203: IC11.16 78.02,17.05 77.47,16.51 77.47,15.75 78.23,14.99 87.88,14.99 89.41,16.51 89.41,19.94 89.97,20.63 X1.D-
N$169
  Top 0.203: X1.VBUS 90.7,19.83 90.3,19.43 90.3,15.37 88.9,13.97 85.21,13.97 F1.1
N$170
  Top 0.203: IC11.17 81.23,17.7 82.17,16.76 C15.1
N$171
  Top 0.203: R5.2 C14.2 84.59,11.55 F1.2
RESET  (via drill 0.51)
  Top 0.203: R73.1 62.1,17.78 64.01,19.68 64.01,24.26 U$5.5 | U1.29 46.59,27.54 46.99,27.94 v46.99,30.48
  Bottom 0.203: U$5.5 62.23,29.21 60.96,30.48 v46.99,30.48
RX  (via drill 0.51)
  Top 0.203: 72.42,24.87 IC11.1 72.42,25.12 71.37,26.16 65.66,26.16 62.61,29.21 v59.69,29.21 | U1.30 47.06,26.74 48.26,27.94 v48.26,29.21
  Bottom 0.203: v48.26,29.21 v59.69,29.21
TX  (via drill 0.51)
  Top 0.203: U1.31 48.04,25.94 v48.26,26.16 | v58.55,27.94 62.99,27.94 68.68,22.25 IC11.5
  Bottom 0.203: v48.26,26.16 56.77,26.16 v58.55,27.94

### Text on the board
tPlace: LED Cube | 2011-11-27 | Joe Ferner